# Altium schematic sheet HMC625_VGA.SchDoc
size A; SheetNumber: 13; SheetTotal: 17
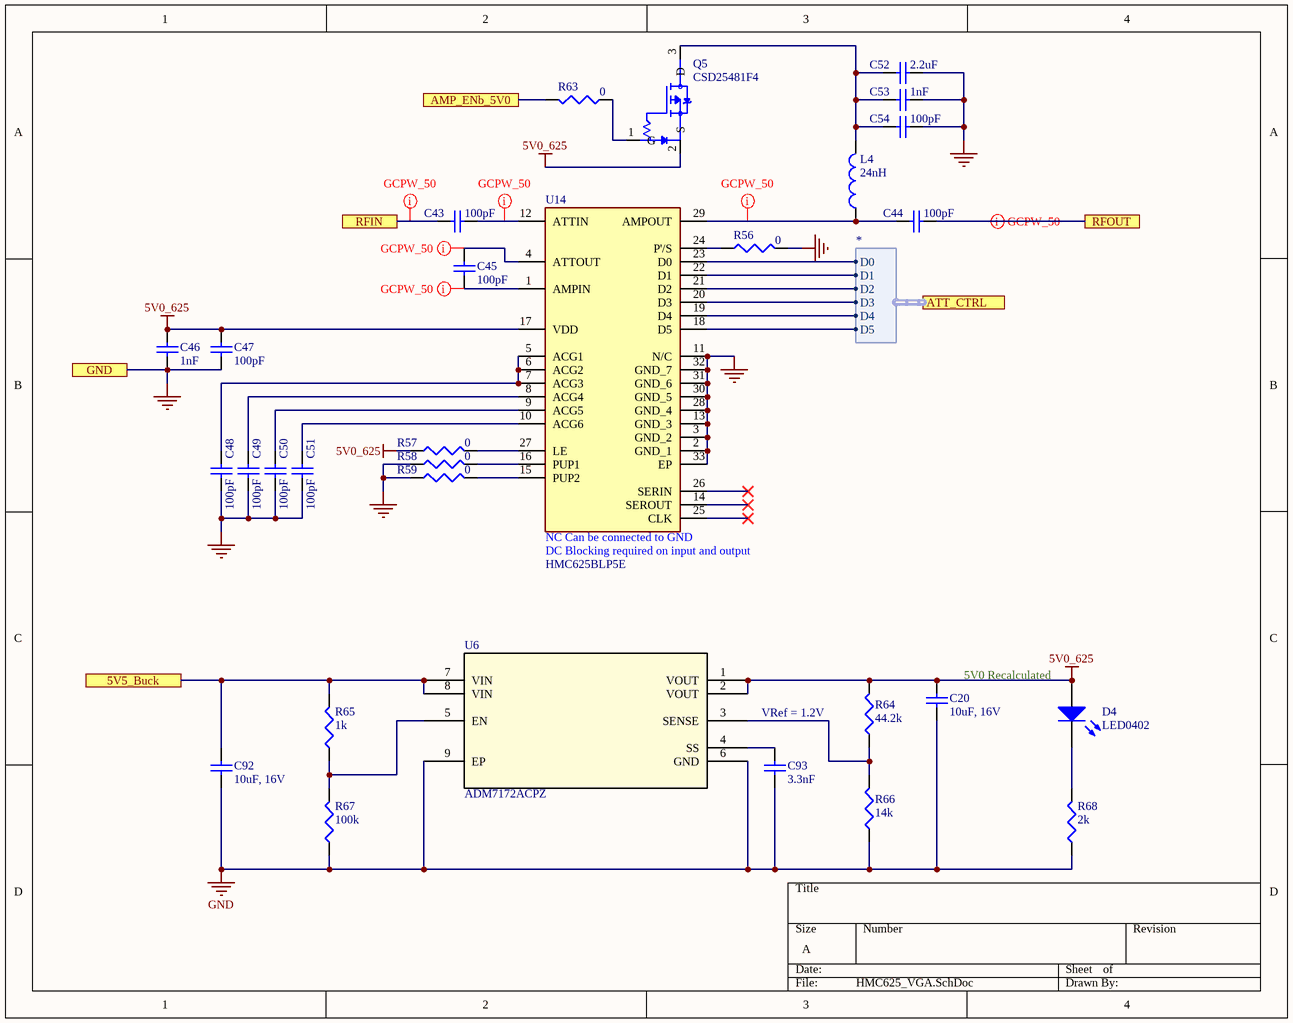
[diagram p0: HMC625_VGA.SchDoc]

## Parts
C20  10uF, 16V  [SMD-0603]
C43  100pF  [SMD-0402]
C44  100pF  [SMD-0402]
C45  100pF  [SMD-0402]
C46  1nF  [SMD-0402]
C47  100pF  [SMD-0402]
C48  100pF  [SMD-0402]
C49  100pF  [SMD-0402]
C50  100pF  [SMD-0402]
C51  100pF  [SMD-0402]
C52  2.2uF  [SMD-0603]
C53  1nF  [SMD-0402]
C54  100pF  [SMD-0402]
C92  10uF, 16V  [SMD-0603]
C93  3.3nF  [Johanson-0201]
D4  LED0402  [LED-0402]
L4  24nH  [L-0402-Coilcraft]
Q5  CSD25481F4  [CSD25481F4]
R56  0  [SMD-0402]
R57  0  [SMD-0402]
R58  0  [SMD-0402]
R59  0  [SMD-0402]
R63  0  [SMD-0402]
R64  44.2k  [SMD-0402]
R65  1k  [SMD-0402]
R66  14k  [SMD-0402]
R67  100k  [SMD-0402]
R68  2k  [SMD-0402]
U6  ADM7172ACPZ  [ADM7172_VIA_NOSILK]
U14  HMC625BLP5E  [Analog Devices HMC625BLP5E]

## Ports
5V5_Buck, AMP_ENb_5V0, ATT_CTRL (harness *), GND, RFIN, RFOUT

## Harnesses
*: D0, D1, D2, D3, D4, D5

## Nets
5V0_625: C20.2 C46.1 C47.1 D4.2(A) Q5.2(S) R57.1 R64.2 U6.1(VOUT) U6.2(VOUT) U14.17(VDD)
GND: C20.1 C46.2 C47.2 C48.2 C49.2 C50.2 C51.2 C52.2 C53.1 C54.1 C92.1 C93.1 R56.2 R58.1 R59.1 R66.1 R67.1 R68.1 U6.6(GND) U6.9(EP) U14.2(GND_1) U14.3(GND_2) U14.11(N/C) U14.13(GND_3) U14.28(GND_4) U14.30(GND_5) U14.31(GND_6) U14.32(GND_7) U14.33(EP) ; port GND
5V5_Buck: C92.2 R65.2 U6.7(VIN) U6.8(VIN) ; port 5V5_Buck
AMP_ENb_5V0: R63.2 ; port AMP_ENb_5V0
RFIN: C43.2 ; port RFIN
RFOUT: C44.1 ; port RFOUT
NetC43_1: C43.1 U14.12(ATTIN)
NetC44_2: C44.2 L4.1 U14.29(AMPOUT)
NetC45_1: C45.1 U14.4(ATTOUT)
NetC45_2: C45.2 U14.1(AMPIN)
NetC48_1: C48.1 U14.5(ACG1) U14.6(ACG2) U14.7(ACG3)
NetC49_1: C49.1 U14.8(ACG4)
NetC50_1: C50.1 U14.9(ACG5)
NetC51_1: C51.1 U14.10(ACG6)
NetC52_1: C52.1 C53.2 C54.2 L4.2 Q5.3(D)
NetC93_2: C93.2 U6.4(SS)
NetD4_1: D4.1(K) R68.2
NetQ5_1: Q5.1(G) R63.1
NetR56_1: R56.1 U14.24(P'/S)
NetR57_2: R57.2 U14.27(LE)
NetR58_2: R58.2 U14.16(PUP1)
NetR59_2: R59.2 U14.15(PUP2)
NetR64_1: R64.1 R66.2 U6.3(SENSE)
NetR65_1: R65.1 R67.2 U6.5(EN)
NetU14_18: U14.18(D5) ; port ATT_CTRL.D5
NetU14_19: U14.19(D4) ; port ATT_CTRL.D4
NetU14_20: U14.20(D3) ; port ATT_CTRL.D3
NetU14_21: U14.21(D2) ; port ATT_CTRL.D2
NetU14_22: U14.22(D1) ; port ATT_CTRL.D1
NetU14_23: U14.23(D0) ; port ATT_CTRL.D0

Not connected (* = marked no-connect by the designer): U14 14(SEROUT)* 25(CLK)* 26(SERIN)*

## Layout directives
net class GCPW_50: NetC43_1, NetC44_2, NetC45_1, NetC45_2, RFIN, RFOUT

## Notes on the sheet
- 5V0 Recalculated
- VRef = 1.2V
- (in symbol HMC625BLP5E) NC Can be connected to GND; DC Blocking required on input and output

## Library data of the parts
C20 C52 C92 = CAP0603: Ceramic Capacitor 0603
C43-C51 C53 C54 = CAP0402: Ceramic Capacitor 0402
C93 = CAP0201: Capacitor 0201 Imperial
D4 = LED0402: LED 0402
L4 = L0402_CoilCraft: Inductor 0402
Q5 = CSD25481F4: -20V, P ch NexFET MOSFET, single LGA 0.6x1.0, 105mOhm 3-PICOSTAR -55 to 150; MF: Texas Instruments; MP: CSD25481F4; Purchase-URL: https://pricing.snapeda.com/search/part/CSD25481F4/?ref=eda; Price: None; SnapEDA_Link: https://www.snapeda.com/parts/CSD25481F4/Texas%20Instruments/view-part/808987/?ref=snap; Check_prices: https://www.snapeda.com/parts/CSD25481F4/Texas%20Instruments/view-part/808987/?ref=eda; Package: PICOSTAR-3 Texas Instruments; Availability: Good; Value: *
R56-R59 R63-R68 = RES0402: Resistor-0402
U6 = ADM7172ACPZ: 6.5V, 2A, Ultralow Noise, High PSRR, Fast Transient Response CMOS LDO; Value: Value; Type: Type; RefDes: RefDes
U14 = HMC625BLP5E: Integrated Circuit; Manufacturer_Name: Analog Devices; Datasheet Link: https://www.analog.com/media/en/technical-documentation/data-sheets/HMC625B.pdf; Height: 1mm; Manufacturer_Part_Number: HMC625BLP5E; Mouser Part Number: 584-HMC625BLP5E; Mouser Price/Stock: https://www.mouser.co.uk/ProductDetail/Analog-Devices/HMC625BLP5E?qs=JeIcUl65ClAr51XD9R3nFw%3D%3D; Arrow Part Number: HMC625BLP5E; Arrow Price/Stock: https://www.arrow.com/en/products/hmc625blp5e/analog-devices